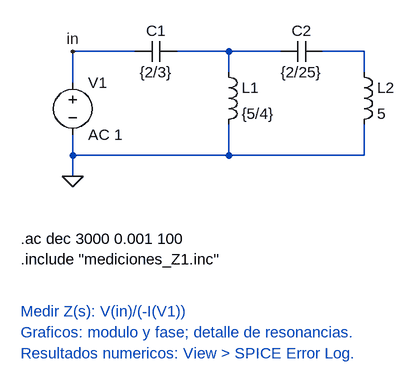
[diagram p0: schematic ejercicio1d.asc]
ejercicio1d.asc, the LTspice schematic file:
Version 4.1
SHEET 1 1000 760
WIRE 160 96 64 96
WIRE 304 96 224 96
WIRE 384 96 304 96
WIRE 512 96 448 96
WIRE 304 128 304 96
WIRE 512 128 512 96
WIRE 64 144 64 96
WIRE 64 256 64 224
WIRE 304 256 304 208
WIRE 304 256 64 256
WIRE 512 256 512 208
WIRE 512 256 304 256
WIRE 64 288 64 256
FLAG 64 288 0
SYMBOL voltage 64 128 R0
SYMATTR InstName V1
SYMATTR Value AC 1
SYMBOL cap 224 80 R90
WINDOW 0 0 32 VBottom 2
WINDOW 3 32 32 VTop 2
SYMATTR InstName C1
SYMATTR Value {2/3}
SYMBOL cap 448 80 R90
WINDOW 0 0 32 VBottom 2
WINDOW 3 32 32 VTop 2
SYMATTR InstName C2
SYMATTR Value {2/25}
SYMBOL ind 288 112 R0
SYMATTR InstName L1
SYMATTR Value {5/4}
SYMATTR SpiceLine Rser=0 Rpar=1e30
SYMBOL ind 496 112 R0
SYMATTR InstName L2
SYMATTR Value 5
SYMATTR SpiceLine Rser=0 Rpar=1e30
FLAG 64 96 in
TEXT -16 384 Left 2 !.ac dec 3000 0.001 100
TEXT -16 416 Left 2 !.include "mediciones_Z1.inc"
TEXT -16 496 Left 2 ;Medir Z(s): V(in)/(-I(V1))
TEXT -16 528 Left 2 ;Graficos: modulo y fase; detalle de resonancias.
TEXT -16 560 Left 2 ;Resultados numericos: View > SPICE Error Log.

The netlist it stands for:
* ejercicio1d.asc
V1 in 0 AC 1
C1 N001 in {2/3}
C2 N002 N001 {2/25}
L1 N001 0 {5/4} Rser=0 Rpar=1e30
L2 N002 0 5 Rser=0 Rpar=1e30
.ac dec 3000 0.001 100
.include "mediciones_Z1.inc"
* Medir Z(s): V(in)/(-I(V1))
* Graficos: modulo y fase; detalle de resonancias.
* Resultados numericos: View > SPICE Error Log.
.backanno
.end

* Results of the author's LTspice run, read from the files saved beside the schematic
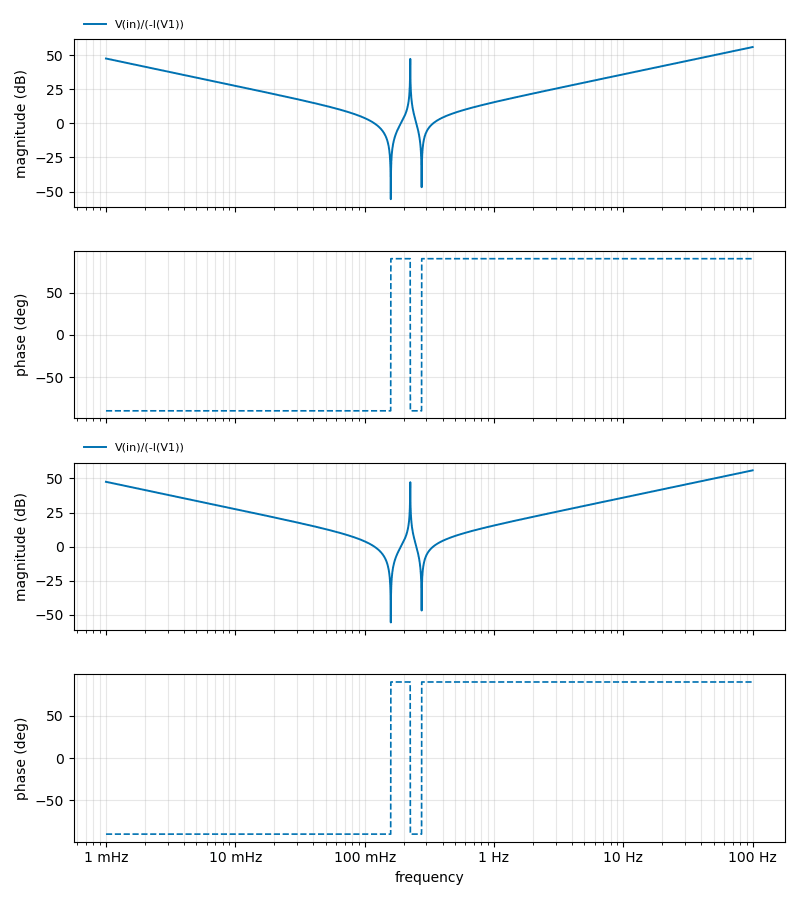
[diagram p1: AC Analysis of ejercicio1d.asc, plotted from the saved traces]
* AC Analysis, 1 run:
*   V(in)/(-I(V1)): 47.56 dB at 1 mHz, 55.96 dB at 100 Hz, peak 92.62 dB at 225.1 mHz, 3 dB below the peak at 225.1 mHz and 225.1 mHz
*   V(in)/(-I(V1)): 47.56 dB at 1 mHz, 55.96 dB at 100 Hz, peak 92.62 dB at 225.1 mHz, 3 dB below the peak at 225.1 mHz and 225.1 mHz